# Altium project traintrackr.PrjPcb
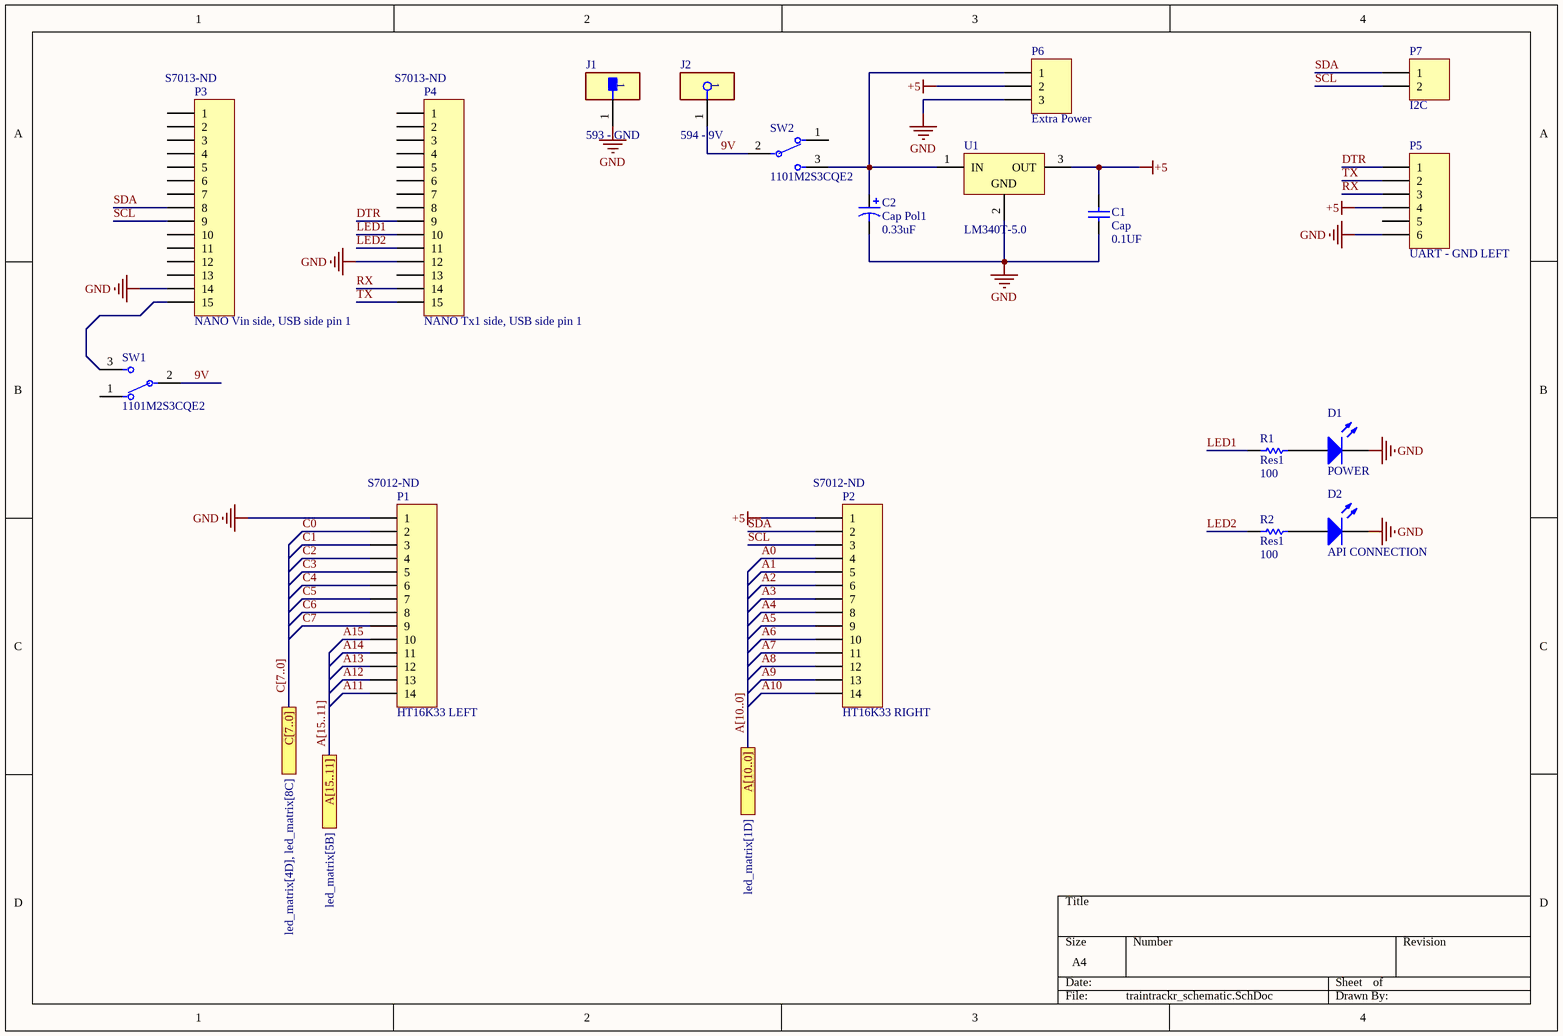
[diagram p0: traintrackr_schematic.SchDoc]
2 sheets, 146 parts. Net scope: flat (ports and power ports of the same name join across sheets).
Board file: traintrackr.PcbDoc
Sheets:
  traintrackr_schematic.SchDoc
  led_matrix.SchDoc

## Sheet traintrackr_schematic.SchDoc
size A4; SheetNumber: 1; SheetTotal: 2; SPICEModelCacheQDKCCJKJ: <root> / <DocumentId>QDKCCJKJ</DocumentId> / <CacheFrame Number="0"> / <Model Name="led1" Kind="MDL"> / <Text>*Typ RED GaAs LED: Vf=1.7V Vr=4V If=40mA trr=3uS / *LED Pinout: 1=A, 2=K / .MODEL LED1 D (IS=93.2P RS=42M N=3.73 BV=4 IBV=10U / + CJO=2.97P VJ=.75 M=.333 TT=4.32U)</Text> / </Model> / </CacheFrame> / </root>

### Parts
C1  Cap  value 0.1UF  [RAD-0.1]
C2  Cap Pol1  value 0.33uF  [Capacitor 330nF]
D1  POWER  [LED_5MM]
D2  API CONNECTION  [LED_5MM]
J1  593 - GND  [FP-593-MFG]
J2  594 - 9V  [FP-594-MFG]
P1  HT16K33 LEFT  Supplier Part Number 1: S7012-ND  [HDR1X14]
P2  HT16K33 RIGHT  Supplier Part Number 1: S7012-ND  [HDR1X14]
P3  NANO Vin side, USB side pin 1  Supplier Part Number 1: S7013-ND  [HDR1X15]
P4  NANO Tx1 side, USB side pin 1  Supplier Part Number 1: S7013-ND  [HDR1X15]
P5  UART - GND LEFT  [HDR1X6H]
P6  Extra Power  [HDR1X3]
P7  I2C  [RAD-0.1]
R1  Res1  value 100  [AXIAL-0.3]
R2  Res1  value 100  [AXIAL-0.3]
SW1  1101M2S3CQE2  [FP-1101M2S3CQE2-MFG]
SW2  1101M2S3CQE2  [FP-1101M2S3CQE2-MFG]
U1  LM340T-5.0  [NDE0003A]

### Ports
A[10..0] (see led_matrix[1D]), A[15..11] (see led_matrix[5B]), C[7..0] (see led_matrix[4D], led_matrix[8C])

### Nets
+5: C1.2 P2.1 P5.4 P6.2 U1.3(OUT)
GND: C1.1 C2.2 D1.2(K) D2.2(K) J1.1 P1.1 P3.14 P4.12 P5.6 P6.3 U1.2(GND)
9V: J2.1 SW1.2(COMM) SW2.2(COMM)
A0: P2.4
A1: P2.5
A2: P2.6
A3: P2.7
A4: P2.8
A5: P2.9
A6: P2.10
A7: P2.11
A8: P2.12
A9: P2.13
A10: P2.14
A11: P1.14
A12: P1.13
A13: P1.12
A14: P1.11
A15: P1.10
C0: P1.2
C1: P1.3
C2: P1.4
C3: P1.5
C4: P1.6
C5: P1.7
C6: P1.8
C7: P1.9
DTR: P4.9 P5.1
LED1: P4.10 R1.1
LED2: P4.11 R2.1
RX: P4.14 P5.3
SCL: P2.3 P3.9 P7.2
SDA: P2.2 P3.8 P7.1
TX: P4.15 P5.2
NetC2_1: C2.1 P6.1 SW2.3 U1.1(IN)
NetD1_1: D1.1(A) R1.2
NetD2_1: D2.1(A) R2.2
NetP3_15: P3.15 SW1.3

Not connected (* = marked no-connect by the designer): P3 1 2 3 4 5 6 7 10 11 12 13; P4 1 2 3 4 5 6 7 8 13; P5 5; SW1 1; SW2 1

### Buses and harness runs
bus A[10..0] = port A[10..0]
bus A[15..11] = port A[15..11]
bus C[7..0] = port C[7..0]

### Library data of the parts
C1 = CAP CER 0.1UF 50V X7R RADIAL: Capacitor; Manufacturer Part Number: K104M15X7RF5TH5; Designator: C?; Voltage Rating: 50V; Published: 8-Jun-2000; LatestRevisionDate: 17-Jul-2002; LatestRevisionNote: Re-released for DXP Platform.; Publisher: Altium Limited
C2 = Cap Pol1: Polarized Capacitor (Radial); Published: 8-Jun-2000; LatestRevisionDate: 17-Jul-2002; LatestRevisionNote: Re-released for DXP Platform.; PackageReference: RB7.6-15; Publisher: Altium Limited; PackageDescription: Polarized Capacitor (Radial); 2 Leads
D1 D2 = LED1: Typical RED GaAs LED; Published: 8-Jun-2000; LatestRevisionDate: 08-Jul-2005; LatestRevisionNote: Mech Layer 1 removed.; PackageReference: LED-1; Publisher: Altium Limited; PackageDescription: LED; 2 Leads
J1 = CMP-19636-000031-1: BATTERY CONTACT SNAP 9V PC PIN; Body Material: Steel; Number of Batteries: 1; Material Thickness: 0.15inch; Gender: Male; Body Plating: Tin; Connector Type: Snap in; Thickness: 0.015inch; Contact Material: Steel; RoHS Compliant: Yes; Package Quantity: 100; Length: 9.65mm; Series: -; Packaging: Bulk; Reach SVHC Compliant: Yes; Contact Plating: Nickel; Lead Free: Lead Free; Termination: PC Pin; Mount: Through Hole; Orientation: Right Angle; Material: Steel; Number of Cells: 1; Contact Type: Snap-In
J2 = CMP-19636-000029-1: BATTERY CONTACT SNAP 9V PC PIN; Body Material: Steel; Material Thickness: 0.15inch; Connector Type: Snap in; Number of Cells: 1; Gender: Female; Body Plating: Tin; Package Quantity: 100; Termination: PC Pin; Thickness: 0.015inch; Reach SVHC Compliant: Yes; RoHS Compliant: Yes; Length: 9.65mm; Contact Plating: Nickel; Contact Type: Snap-In; Material: Steel; Packaging: Bulk; Orientation: Right Angle; Mount: Through Hole; Lead Free: Lead Free; Series: -; Number of Batteries: 1; Contact Material: Steel
P1 P2 = Header 14: Header, 14-Pin; LatestRevisionDate: 17-Jul-2002; LatestRevisionNote: Re-released for DXP Platform.; Publisher: Altium Limited; Supplier 1: Digi-Key
P3 P4 = Header 15: Header, 15-Pin; LatestRevisionDate: 17-Jul-2002; LatestRevisionNote: Re-released for DXP Platform.; Publisher: Altium Limited; Supplier 1: Digi-Key
P5 = Header 6H: Header, 6-Pin, Right Angle; LatestRevisionDate: 17-Jul-2002; LatestRevisionNote: Re-released for DXP Platform.; Publisher: Altium Limited; Supplier 1: Digi-Key; Supplier Part Number 1: S1111EC-06-ND
P6 = Header 3: Header, 3-Pin; LatestRevisionDate: 17-Jul-2002; LatestRevisionNote: Re-released for DXP Platform.; Publisher: Altium Limited; Supplier 1: Digi-Key; Supplier Part Number 1: 2057-PH1-20-UA-ND
P7 = Header 2H: Header, 2-Pin, Right Angle; LatestRevisionDate: 17-Jul-2002; LatestRevisionNote: Re-released for DXP Platform.; Publisher: Altium Limited; Supplier 1: Digi-Key; Supplier Part Number 1: 2057-PH1-20-UA-ND
R1 R2 = Res1: Resistor; Published: 8-Jun-2000; LatestRevisionDate: 17-Jul-2002; LatestRevisionNote: Re-released for DXP Platform.; PackageReference: AXIAL-0.3; Publisher: Altium Limited; PackageDescription: Axial Device, Thru-Hole; 2 Leads; 0.3 in Pin Spacing
SW1 SW2 = CMP-10038-000019-1: SWITCH SLIDE SPDT 6A 120V; Switch Travel: 2.16mm; Number of Positions: 3; Number of Poles: 1; Approvals: UL; Actuator Length: 5.08mm; Voltage Rating (DC): 28V; Max Voltage Rating (AC): 250V; Insulation Resistance: 1GR; Body Material: Stainless Steel; Actuator Type: Standard; Contact Resistance: 10mR; Switch Function: On-On; Actuator Material: Nylon; Actuator Color: Black; Electrical Life: 40000Cycles; Termination: PC Pins; Packaging: Bulk; Housing Material: Stainless Steel; Flammability Rating: UL94 V-0; Series: 1000; Contact Current Rating: 6A; Length: 12.7mm; Depth: 6.6mm; Orientation: Vertical; Max Current Rating: 6A; Max Operating Temperature: 65°C; Throw Configuration: SPDT; REACH SVHC: No SVHC; Contact Material: Copper; Max Voltage Rating (DC): 28V; Lead Free: Lead Free; Current Rating: 6A; Voltage Rating (AC): 120V; Contact Plating: Silver; Package Quantity: 1; Min Operating Temperature: -30°C; Mount: Through Hole
U1 = CMP-0062-02468-3: Series 3-Terminal Positive Regulators, 3-pin TO-220; Manufacturer: Texas Instruments; PowerWise: N; CompType: LDO IC; PackageTopMarking: NSUZXYTTE#*LM340T5*7805 P+; RoHS: N; ComponentLink1URL: http://www.ti.com/general/docs/lit/getliterature.tsp?genericPartNumber=LM340-N&fileType=pdf; PinCount: 3; PackageReference: NDE0003A; ComponentLink1Description: Datasheet URL; PackageDescription: TO-220, Molded, 3 Lead, Straight

## Sheet led_matrix.SchDoc
size A3; SheetNumber: 2; SheetTotal: 2; SPICEModelCacheWOCWTUTU: <root> / <DocumentId>WOCWTUTU</DocumentId> / <CacheFrame Number="0"> / <Model Name="led1" Kind="MDL"> / <Text>*Typ RED GaAs LED: Vf=1.7V Vr=4V If=40mA trr=3uS / *LED Pinout: 1=A, 2=K / .MODEL LED1 D (IS=93.2P RS=42M N=3.73 BV=4 IBV=10U / + CJO=2.97P VJ=.75 M=.333 TT=4.32U)</Text> / </Model> / </CacheFrame> / </root>
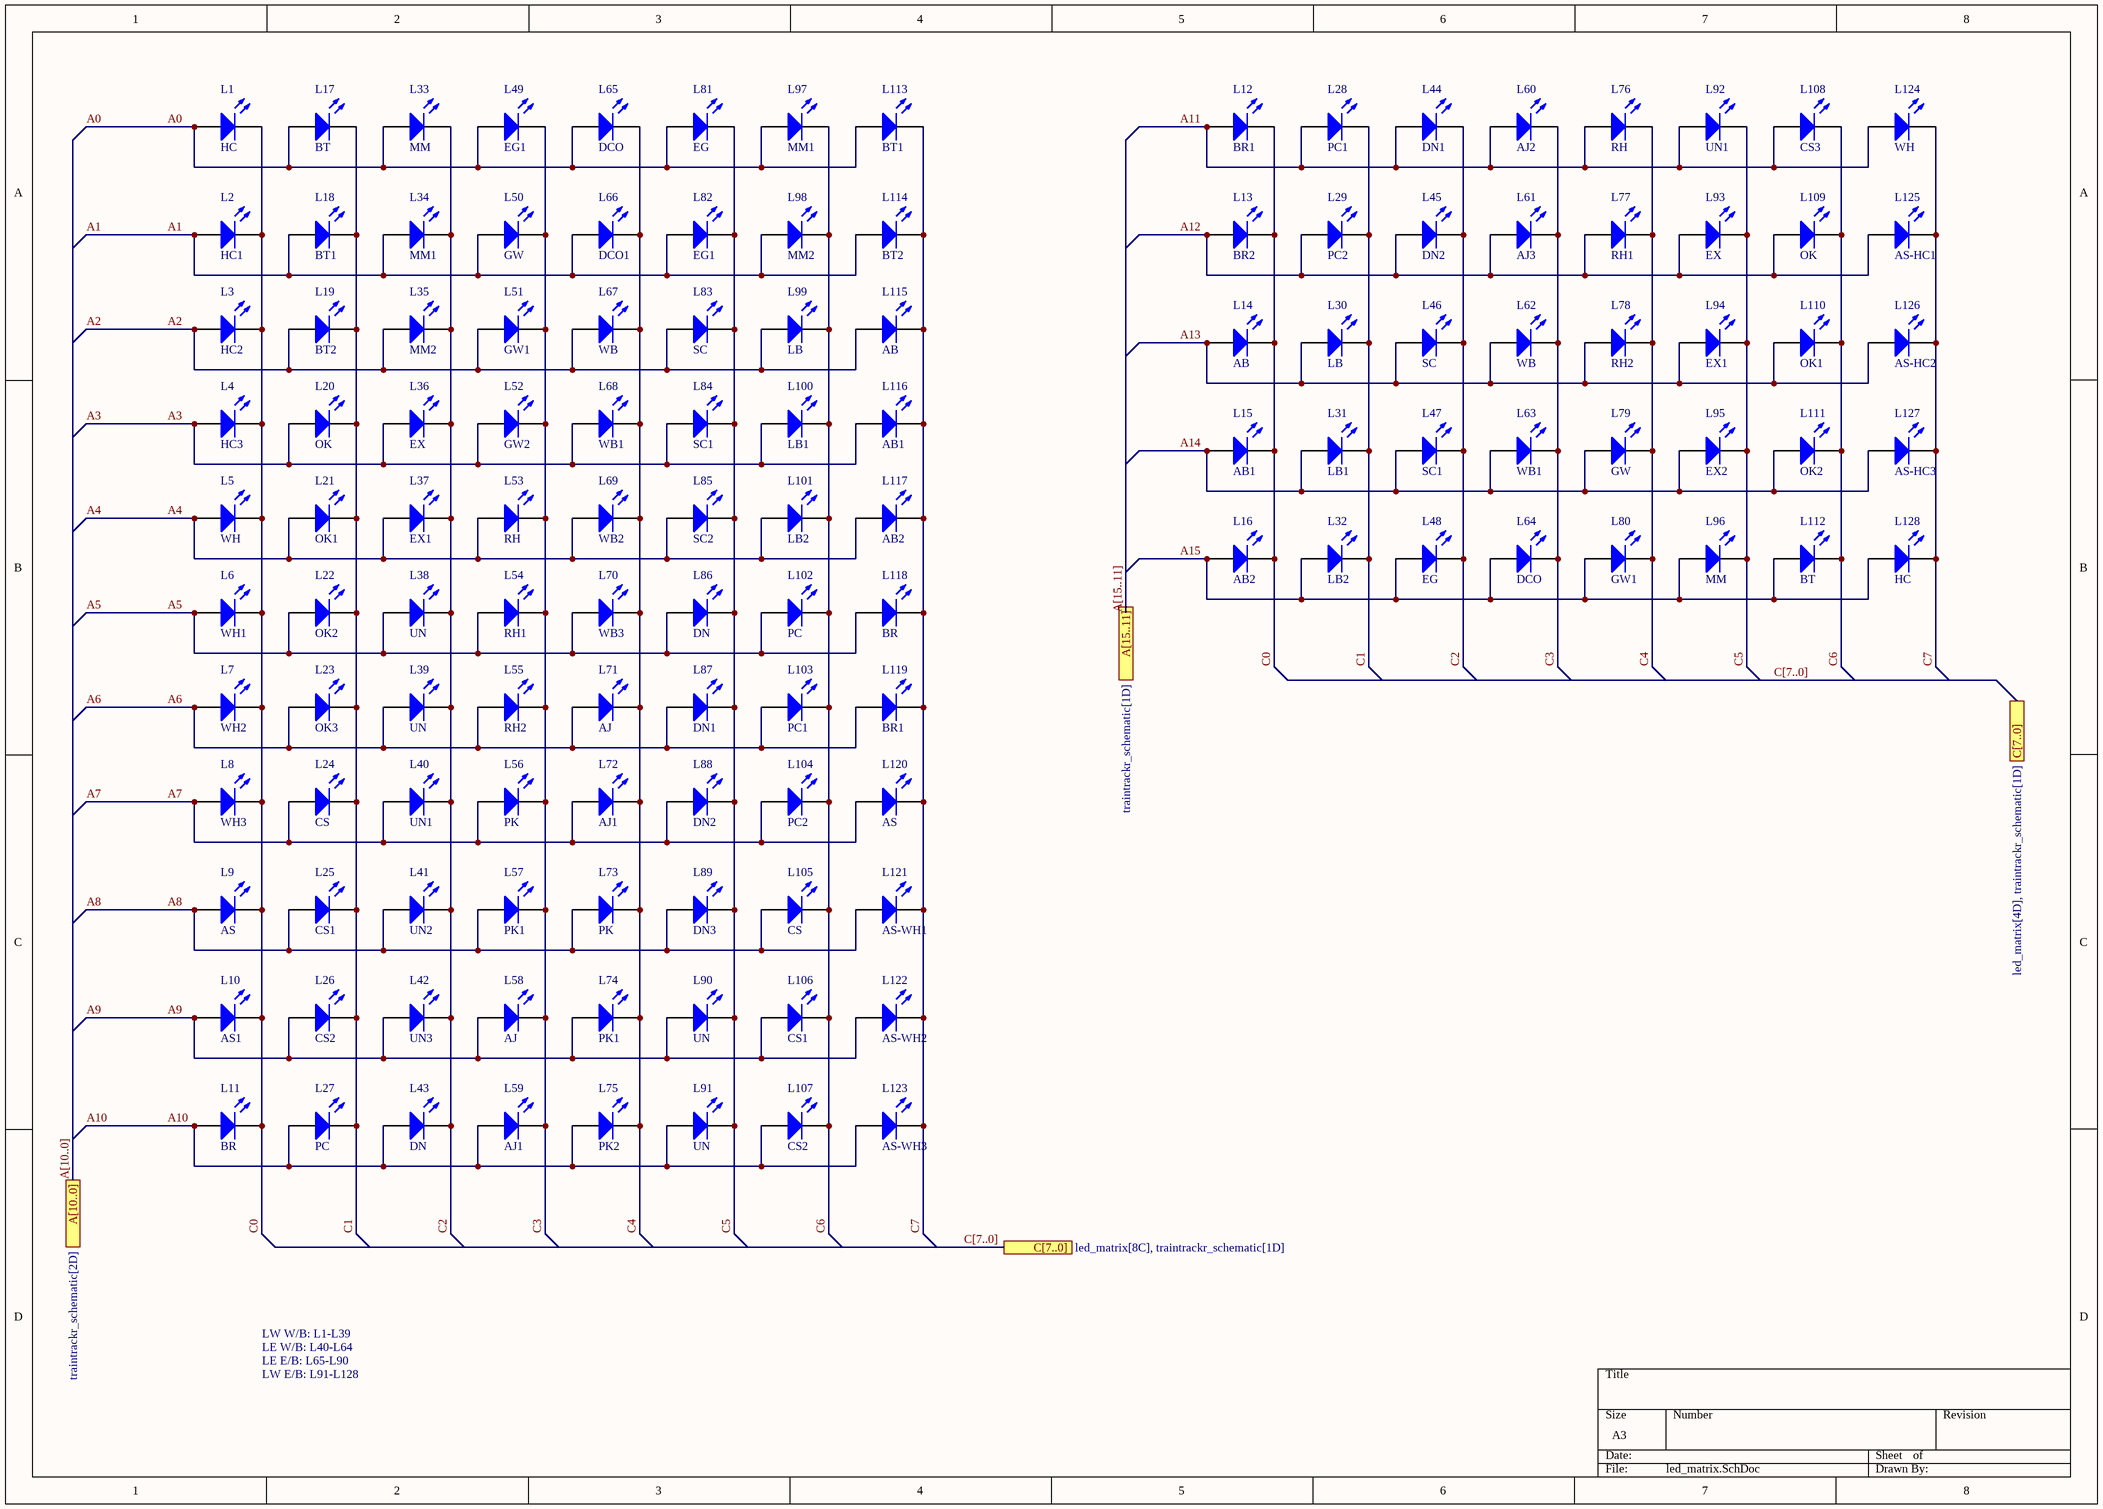
[diagram p1: led_matrix.SchDoc]

### Parts
L1  HC  [PCBComponent_1]
L2  HC1  [PCBComponent_1]
L3  HC2  [PCBComponent_1]
L4  HC3  [PCBComponent_1]
L5  WH  [PCBComponent_1]
L6  WH1  [PCBComponent_1]
L7  WH2  [PCBComponent_1]
L8  WH3  [PCBComponent_1]
L9  AS  [PCBComponent_1]
L10  AS1  [PCBComponent_1]
L11  BR  [PCBComponent_1]
L12  BR1  [PCBComponent_1]
L13  BR2  [PCBComponent_1]
L14  AB  [PCBComponent_1]
L15  AB1  [PCBComponent_1]
L16  AB2  [PCBComponent_1]
L17  BT  [PCBComponent_1]
L18  BT1  [PCBComponent_1]
L19  BT2  [PCBComponent_1]
L20  OK  [PCBComponent_1]
L21  OK1  [PCBComponent_1]
L22  OK2  [PCBComponent_1]
L23  OK3  [PCBComponent_1]
L24  CS  [PCBComponent_1]
L25  CS1  [PCBComponent_1]
L26  CS2  [PCBComponent_1]
L27  PC  [PCBComponent_1]
L28  PC1  [PCBComponent_1]
L29  PC2  [PCBComponent_1]
L30  LB  [PCBComponent_1]
L31  LB1  [PCBComponent_1]
L32  LB2  [PCBComponent_1]
L33  MM  [PCBComponent_1]
L34  MM1  [PCBComponent_1]
L35  MM2  [PCBComponent_1]
L36  EX  [PCBComponent_1]
L37  EX1  [PCBComponent_1]
L38  UN  [PCBComponent_1]
L39  UN  [PCBComponent_1]
L40  UN1  [PCBComponent_1]
L41  UN2  [PCBComponent_1]
L42  UN3  [PCBComponent_1]
L43  DN  [PCBComponent_1]
L44  DN1  [PCBComponent_1]
L45  DN2  [PCBComponent_1]
L46  SC  [PCBComponent_1]
L47  SC1  [PCBComponent_1]
L48  EG  [PCBComponent_1]
L49  EG1  [PCBComponent_1]
L50  GW  [PCBComponent_1]
L51  GW1  [PCBComponent_1]
L52  GW2  [PCBComponent_1]
L53  RH  [PCBComponent_1]
L54  RH1  [PCBComponent_1]
L55  RH2  [PCBComponent_1]
L56  PK  [PCBComponent_1]
L57  PK1  [PCBComponent_1]
L58  AJ  [PCBComponent_1]
L59  AJ1  [PCBComponent_1]
L60  AJ2  [PCBComponent_1]
L61  AJ3  [PCBComponent_1]
L62  WB  [PCBComponent_1]
L63  WB1  [PCBComponent_1]
L64  DCO  [PCBComponent_1]
L65  DCO  [PCBComponent_1]
L66  DCO1  [PCBComponent_1]
L67  WB  [PCBComponent_1]
L68  WB1  [PCBComponent_1]
L69  WB2  [PCBComponent_1]
L70  WB3  [PCBComponent_1]
L71  AJ  [PCBComponent_1]
L72  AJ1  [PCBComponent_1]
L73  PK  [PCBComponent_1]
L74  PK1  [PCBComponent_1]
L75  PK2  [PCBComponent_1]
L76  RH  [PCBComponent_1]
L77  RH1  [PCBComponent_1]
L78  RH2  [PCBComponent_1]
L79  GW  [PCBComponent_1]
L80  GW1  [PCBComponent_1]
L81  EG  [PCBComponent_1]
L82  EG1  [PCBComponent_1]
L83  SC  [PCBComponent_1]
L84  SC1  [PCBComponent_1]
L85  SC2  [PCBComponent_1]
L86  DN  [PCBComponent_1]
L87  DN1  [PCBComponent_1]
L88  DN2  [PCBComponent_1]
L89  DN3  [PCBComponent_1]
L90  UN  [PCBComponent_1]
L91  UN  [PCBComponent_1]
L92  UN1  [PCBComponent_1]
L93  EX  [PCBComponent_1]
L94  EX1  [PCBComponent_1]
L95  EX2  [PCBComponent_1]
L96  MM  [PCBComponent_1]
L97  MM1  [PCBComponent_1]
L98  MM2  [PCBComponent_1]
L99  LB  [PCBComponent_1]
L100  LB1  [PCBComponent_1]
L101  LB2  [PCBComponent_1]
L102  PC  [PCBComponent_1]
L103  PC1  [PCBComponent_1]
L104  PC2  [PCBComponent_1]
L105  CS  [PCBComponent_1]
L106  CS1  [PCBComponent_1]
L107  CS2  [PCBComponent_1]
L108  CS3  [PCBComponent_1]
L109  OK  [PCBComponent_1]
L110  OK1  [PCBComponent_1]
L111  OK2  [PCBComponent_1]
L112  BT  [PCBComponent_1]
L113  BT1  [PCBComponent_1]
L114  BT2  [PCBComponent_1]
L115  AB  [PCBComponent_1]
L116  AB1  [PCBComponent_1]
L117  AB2  [PCBComponent_1]
L118  BR  [PCBComponent_1]
L119  BR1  [PCBComponent_1]
L120  AS  [PCBComponent_1]
L121  AS-WH1  [PCBComponent_1]
L122  AS-WH2  [PCBComponent_1]
L123  AS-WH3  [PCBComponent_1]
L124  WH  [PCBComponent_1]
L125  AS-HC1  [PCBComponent_1]
L126  AS-HC2  [PCBComponent_1]
L127  AS-HC3  [PCBComponent_1]
L128  HC  [PCBComponent_1]

### Ports
A[10..0] (see traintrackr_schematic[2D]), A[15..11] (see traintrackr_schematic[1D]), C[7..0] (see led_matrix[4D], traintrackr_schematic[1D]), C[7..0] (see led_matrix[8C], traintrackr_schematic[1D])

### Nets
A0: L1.1(A) L17.1(A) L33.1(A) L49.1(A) L65.1(A) L81.1(A) L97.1(A) L113.1(A)
A1: L2.1(A) L18.1(A) L34.1(A) L50.1(A) L66.1(A) L82.1(A) L98.1(A) L114.1(A)
A2: L3.1(A) L19.1(A) L35.1(A) L51.1(A) L67.1(A) L83.1(A) L99.1(A) L115.1(A)
A3: L4.1(A) L20.1(A) L36.1(A) L52.1(A) L68.1(A) L84.1(A) L100.1(A) L116.1(A)
A4: L5.1(A) L21.1(A) L37.1(A) L53.1(A) L69.1(A) L85.1(A) L101.1(A) L117.1(A)
A5: L6.1(A) L22.1(A) L38.1(A) L54.1(A) L70.1(A) L86.1(A) L102.1(A) L118.1(A)
A6: L7.1(A) L23.1(A) L39.1(A) L55.1(A) L71.1(A) L87.1(A) L103.1(A) L119.1(A)
A7: L8.1(A) L24.1(A) L40.1(A) L56.1(A) L72.1(A) L88.1(A) L104.1(A) L120.1(A)
A8: L9.1(A) L25.1(A) L41.1(A) L57.1(A) L73.1(A) L89.1(A) L105.1(A) L121.1(A)
A9: L10.1(A) L26.1(A) L42.1(A) L58.1(A) L74.1(A) L90.1(A) L106.1(A) L122.1(A)
A10: L11.1(A) L27.1(A) L43.1(A) L59.1(A) L75.1(A) L91.1(A) L107.1(A) L123.1(A)
A11: L12.1(A) L28.1(A) L44.1(A) L60.1(A) L76.1(A) L92.1(A) L108.1(A) L124.1(A)
A12: L13.1(A) L29.1(A) L45.1(A) L61.1(A) L77.1(A) L93.1(A) L109.1(A) L125.1(A)
A13: L14.1(A) L30.1(A) L46.1(A) L62.1(A) L78.1(A) L94.1(A) L110.1(A) L126.1(A)
A14: L15.1(A) L31.1(A) L47.1(A) L63.1(A) L79.1(A) L95.1(A) L111.1(A) L127.1(A)
A15: L16.1(A) L32.1(A) L48.1(A) L64.1(A) L80.1(A) L96.1(A) L112.1(A) L128.1(A)
C0: L1.2(K) L2.2(K) L3.2(K) L4.2(K) L5.2(K) L6.2(K) L7.2(K) L8.2(K) L9.2(K) L10.2(K) L11.2(K) L12.2(K) L13.2(K) L14.2(K) L15.2(K) L16.2(K)
C1: L17.2(K) L18.2(K) L19.2(K) L20.2(K) L21.2(K) L22.2(K) L23.2(K) L24.2(K) L25.2(K) L26.2(K) L27.2(K) L28.2(K) L29.2(K) L30.2(K) L31.2(K) L32.2(K)
C2: L33.2(K) L34.2(K) L35.2(K) L36.2(K) L37.2(K) L38.2(K) L39.2(K) L40.2(K) L41.2(K) L42.2(K) L43.2(K) L44.2(K) L45.2(K) L46.2(K) L47.2(K) L48.2(K)
C3: L49.2(K) L50.2(K) L51.2(K) L52.2(K) L53.2(K) L54.2(K) L55.2(K) L56.2(K) L57.2(K) L58.2(K) L59.2(K) L60.2(K) L61.2(K) L62.2(K) L63.2(K) L64.2(K)
C4: L65.2(K) L66.2(K) L67.2(K) L68.2(K) L69.2(K) L70.2(K) L71.2(K) L72.2(K) L73.2(K) L74.2(K) L75.2(K) L76.2(K) L77.2(K) L78.2(K) L79.2(K) L80.2(K)
C5: L81.2(K) L82.2(K) L83.2(K) L84.2(K) L85.2(K) L86.2(K) L87.2(K) L88.2(K) L89.2(K) L90.2(K) L91.2(K) L92.2(K) L93.2(K) L94.2(K) L95.2(K) L96.2(K)
C6: L97.2(K) L98.2(K) L99.2(K) L100.2(K) L101.2(K) L102.2(K) L103.2(K) L104.2(K) L105.2(K) L106.2(K) L107.2(K) L108.2(K) L109.2(K) L110.2(K) L111.2(K) L112.2(K)
C7: L113.2(K) L114.2(K) L115.2(K) L116.2(K) L117.2(K) L118.2(K) L119.2(K) L120.2(K) L121.2(K) L122.2(K) L123.2(K) L124.2(K) L125.2(K) L126.2(K) L127.2(K) L128.2(K)

### Buses and harness runs
bus A[10..0] = port A[10..0]
bus A[15..11] = port A[15..11]
bus C[7..0] = port C[7..0]

### Notes on the sheet
- LW W/B: L1-L39
- LE W/B: L40-L64
- LE E/B: L65-L90
- LW E/B: L91-L128

### Library data of the parts
L1-L128 = LED1: Typical RED GaAs LED; Published: 8-Jun-2000; LatestRevisionDate: 08-Jul-2005; LatestRevisionNote: Mech Layer 1 removed.; PackageReference: LED-1; Publisher: Altium Limited; PackageDescription: LED; 2 Leads

## Nets that join several sheets
A0: traintrackr_schematic (P2.4), led_matrix (8 pins)
A1: traintrackr_schematic (P2.5), led_matrix (8 pins)
A2: traintrackr_schematic (P2.6), led_matrix (8 pins)
A3: traintrackr_schematic (P2.7), led_matrix (8 pins)
A4: traintrackr_schematic (P2.8), led_matrix (8 pins)
A5: traintrackr_schematic (P2.9), led_matrix (8 pins)
A6: traintrackr_schematic (P2.10), led_matrix (8 pins)
A7: traintrackr_schematic (P2.11), led_matrix (8 pins)
A8: traintrackr_schematic (P2.12), led_matrix (8 pins)
A9: traintrackr_schematic (P2.13), led_matrix (8 pins)
A10: traintrackr_schematic (P2.14), led_matrix (8 pins)
A11: traintrackr_schematic (P1.14), led_matrix (8 pins)
A12: traintrackr_schematic (P1.13), led_matrix (8 pins)
A13: traintrackr_schematic (P1.12), led_matrix (8 pins)
A14: traintrackr_schematic (P1.11), led_matrix (8 pins)
A15: traintrackr_schematic (P1.10), led_matrix (8 pins)
C0: traintrackr_schematic (P1.2), led_matrix (16 pins)
C1: traintrackr_schematic (P1.3), led_matrix (16 pins)
C2: traintrackr_schematic (P1.4), led_matrix (16 pins)
C3: traintrackr_schematic (P1.5), led_matrix (16 pins)
C4: traintrackr_schematic (P1.6), led_matrix (16 pins)
C5: traintrackr_schematic (P1.7), led_matrix (16 pins)
C6: traintrackr_schematic (P1.8), led_matrix (16 pins)
C7: traintrackr_schematic (P1.9), led_matrix (16 pins)